# EAGLE design Maduino Zero Bluetooth 4.0 HM-13 v1.0 (EAGLE 6.1)
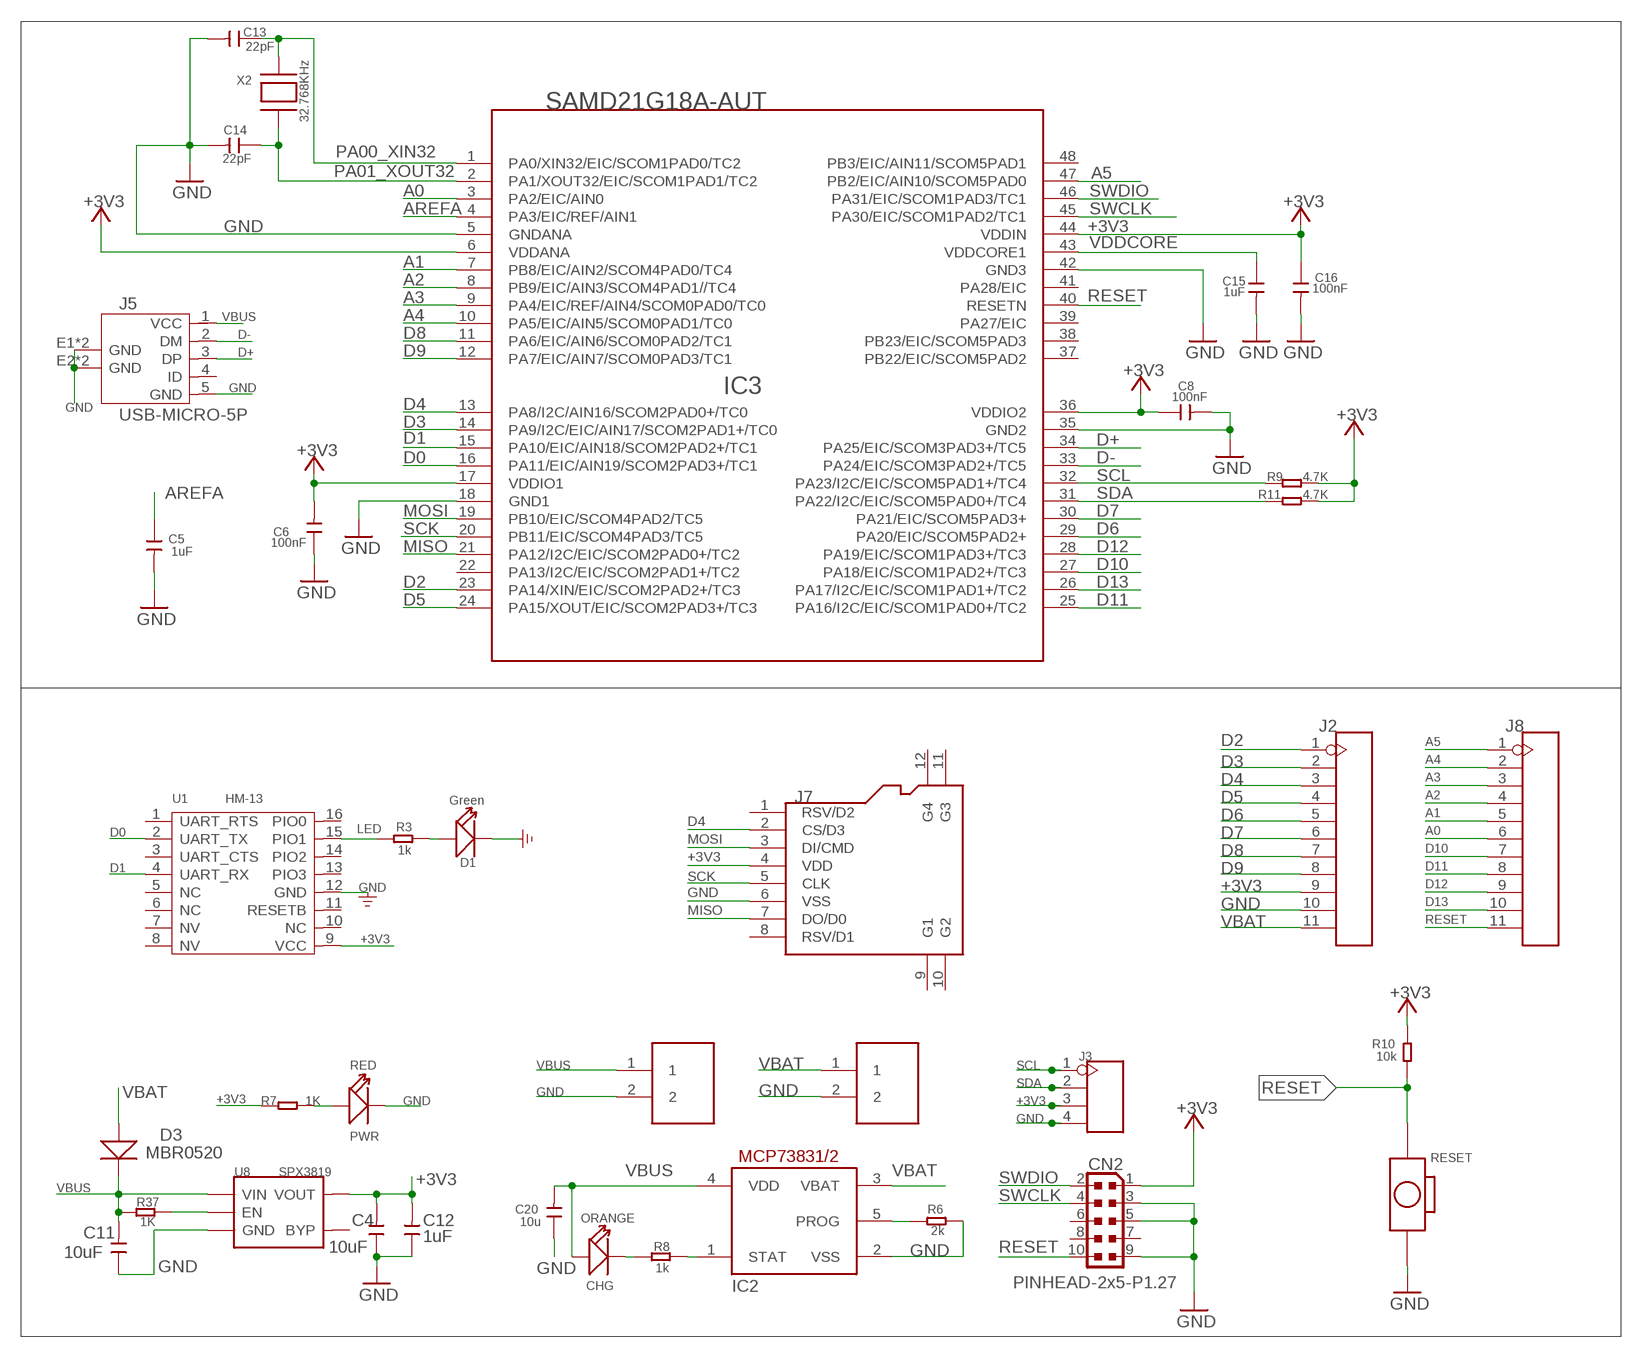
[diagram p0: schematic, sheet 1]

## Parts
C4  10uF  C-0603  [0603]
C5  1uF  C-0603  [0603]
C6  100nF  C-0603  [0603]
C8  100nF  C-0603  [0603]
C11  10uF  C-0603  [0603]
C12  1uF  C-0603  [0603]
C13  22pF  C-0603  [0603]
C14  22pF  C-0603  [0603]
C15  1uF  C-0603  [0603]
C16  100nF  C-0603  [0603]
C20  10u  C-0603  [0603]
CHG  ORANGE  007-LED0603  [D0603]
CN2  PINHEAD-2x5-P1.27  0171_PH127-205DF055G00AROUND-PADS  [PINHEAD_2X05_127]
D1  Green  LED'0603'  [LED-0603]
D3  MBR0520  D'1206'  [SOD123]
IC2  MCP73831/OT  [SOT23-5L]
IC3  SAMD21G18A-AUT  ATSAMD21G18A-AUT  [TQFP48-7X7]
J1  PH2.0-2P-90-DIP  [PH2.0-2P-90-DIP]
J2  HEADER-11P-2.54  [11P-2.54]
J3  HEADER-4P-60/35MILROUND  [4P-65/35ROUND]
J5  USB-MICRO-5P  [MICRO-USB-5P]
J6  PH2.0-2P-90-DIP  [PH2.0-2P-90-DIP]
J7  HOLDER-MICROSD-8P  [8P-SMD]
J8  HEADER-11P-2.54  [11P-2.54]
PWR  RED  LED'0603'  [LED-0603]
R3  1k  R-0603  [R0603]
R6  2k  R-0603  [R0603]
R7  1K  R-0603  [R0603]
R8  1k  R-0603  [R0603]
R9  4.7K  R-0603  [R0603]
R10  10k  R-0603  [R0603]
R11  4.7K  R-0603  [R0603]
R37  1K  R-0603  [R0603]
RESET  BOTTON-2P-90D  [2P-7.62X3.56-90D]
U1  HM-13  HM-11  [16P-18.5X13.5X0.8]
U8  SPX3819  [SOT23-5]
X2  32.768KHz  XTAL-3.2X1.5  [XTAL3215]

## Nets
+3V3: C4.2 C6.2 C8.1 C12.2 C16.1 CN2.1 IC3.6(VDDANA) IC3.17(VDDIO1) IC3.36(VDDIO2) IC3.44(VDDIN) J2.9 J3.3 J7.4(VDD) R7.1 R9.2 R10.2 R11.2 U1.9(VCC) U8.5(VOUT)
A0: IC3.3(PA2/EIC/AIN0) J8.6
A1: IC3.7(PB8/EIC/AIN2/SCOM4PAD0/TC4) J8.5
A2: IC3.8(PB9/EIC/AIN3/SCOM4PAD1//TC4) J8.4
A3: IC3.9(PA4/EIC/REF/AIN4/SCOM0PAD0/TC0) J8.3
A4: IC3.10(PA5/EIC/AIN5/SCOM0PAD1/TC0) J8.2
A5: IC3.47(PB2/EIC/AIN10/SCOM5PAD0) J8.1
AREFA: C5.1 IC3.4(PA3/EIC/REF/AIN1)
D0: IC3.16(PA11/EIC/AIN19/SCOM2PAD3+/TC1) U1.2(UART_TX)
D1: IC3.15(PA10/EIC/AIN18/SCOM2PAD2+/TC1) U1.4(UART_RX)
D2: IC3.23(PA14/XIN/EIC/SCOM2PAD2+/TC3) J2.1
D3: IC3.14(PA9/I2C/EIC/AIN17/SCOM2PAD1+/TC0) J2.2
D4: IC3.13(PA8/I2C/AIN16/SCOM2PAD0+/TC0) J2.3 J7.2(CS/D3)
D5: IC3.24(PA15/XOUT/EIC/SCOM2PAD3+/TC3) J2.4
D6: IC3.29(PA20/EIC/SCOM5PAD2+) J2.5
D7: IC3.30(PA21/EIC/SCOM5PAD3+) J2.6
D8: IC3.11(PA6/EIC/AIN6/SCOM0PAD2/TC1) J2.7
D9: IC3.12(PA7/EIC/AIN7/SCOM0PAD3/TC1) J2.8
D10: IC3.27(PA18/EIC/SCOM1PAD2+/TC3) J8.7
D11: IC3.25(PA16/I2C/EIC/SCOM1PAD0+/TC2) J8.8
D12: IC3.28(PA19/EIC/SCOM1PAD3+/TC3) J8.9
D13: IC3.26(PA17/I2C/EIC/SCOM1PAD1+/TC2) J8.10
D+: IC3.34(PA25/EIC/SCOM3PAD3+/TC5) J5.3(DP)
D-: IC3.33(PA24/EIC/SCOM3PAD2+/TC5) J5.2(DM)
GND: C4.1 C5.2 C6.1 C8.2 C11.1 C12.1 C13.2 C14.2 C15.2 C16.2 C20.1 CN2.3 CN2.5 CN2.9 D1.- IC2.2(VSS) IC3.5(GNDANA) IC3.18(GND1) IC3.35(GND2) IC3.42(GND3) J1.2 J2.10 J3.4 J5.5(GND) J5.E1(GND) J5.E2(GND) J5.P1(GND) J5.P2(GND) J6.2 J7.6(VSS) PWR.- R6.2 RESET.P$2 U1.12(GND) U8.2(GND)
LED: R3.1 U1.15(PIO1)
MISO: IC3.21(PA12/I2C/EIC/SCOM2PAD0+/TC2) J7.7(DO/D0)
MOSI: IC3.19(PB10/EIC/SCOM4PAD2/TC5) J7.3(DI/CMD)
N$3: PWR.+ R7.2
N$7: D1.+ R3.2
N$24: R37.2 U8.3(EN)
N$25: CHG.- R8.1
N$26: IC2.1(STAT) R8.2
N$31: IC2.5(PROG) R6.1
PA00_XIN32: C13.1 IC3.1(PA0/XIN32/EIC/SCOM1PAD0/TC2) X2.P$2
PA01_XOUT32: C14.1 IC3.2(PA1/XOUT32/EIC/SCOM1PAD1/TC2) X2.P$1
RESET: CN2.10 IC3.40(RESETN) J8.11 R10.1 RESET.P$1
SCK: IC3.20(PB11/EIC/SCOM4PAD3/TC5) J7.5(CLK)
SCL: IC3.32(PA23/I2C/EIC/SCOM5PAD1+/TC4) J3.1 R9.1
SDA: IC3.31(PA22/I2C/EIC/SCOM5PAD0+/TC4) J3.2 R11.1
SWCLK: CN2.4 IC3.45(PA30/EIC/SCOM1PAD2/TC1)
SWDIO: CN2.2 IC3.46(PA31/EIC/SCOM1PAD3/TC1)
VBAT: D3.+ IC2.3(VBAT) J2.11 J6.1
VBUS: C11.2 C20.2 CHG.+ D3.- IC2.4(VDD) J1.1 J5.1(VCC) R37.1 U8.1(VIN)
VDDCORE: C15.1 IC3.43(VDDCORE1)
Unconnected: CN2.6 CN2.7 CN2.8 IC3.22(PA13/I2C/EIC/SCOM2PAD1+/TC2) IC3.37(PB22/EIC/SCOM5PAD2) IC3.38(PB23/EIC/SCOM5PAD3) IC3.39(PA27/EIC) IC3.41(PA28/EIC) IC3.48(PB3/EIC/AIN11/SCOM5PAD1) J5.4(ID) J7.1(RSV/D2) J7.8(RSV/D1) J7.9(G1) J7.10(G2) J7.11(G3) J7.12(G4) U1.1(UART_RTS) U1.3(UART_CTS) U1.5(NC) U1.6(NC) U1.7(NV) U1.8(NV) U1.10(NC) U1.11(RESETB) U1.13(PIO3) U1.14(PIO2) U1.16(PIO0) U8.4(BYP)

## Library data of the parts
C4-C6 C8 C11-C16 C20 = Discrete:C*: Ceramic Capacitors
CHG = Discrete:007-LED*
CN2 = Connettori:0171_PH127-205DF055G00A: 2x5 PASSO 1,27
D1 PWR = Discrete:LED*
D3 = Discrete:D*
IC2 = adafruit:MCP73831: MCP73831/2 Miniature Single-Cell, Fully Integrated Li-Ion, Li-Polymer Charge Management Controllers. Nice and small simple lipoly charge controller, with adjustable current and status output (LED) http://www.ladyada.net/library/pcb/eaglelibrary.html
IC3 = IC:ATSAMD21G18A-AUT: Atmel D21 32bit ARM Cortex-M0 microcontroller - 48 PIN TQFP 256KB flash memory + 32KB SRAM
J1 J6 = Connector:PH2.0-2P-90-DIP
J2 J8 = Connector:HEADER-11P
J3 = Connector:HEADER-4P
J5 = Connector:USB-MICRO-5P
J7 = Connector:HOLDER-MICROSD-8P
R3 R6-R11 R37 = Discrete:R*
RESET = Discrete:BOTTON-2P
U1 = template:HM-11: Bluetooth Specification V4.0 BLE
U8 = IC:SPX3819
X2 = adafruit2:XTAL: Low cost SMT crystals, no capacitors included http://www.ladyada.net/library/eagle

## Net classes
0 default: width 0.203 mm, drill 0.305 mm, clearance 0.203 mm
2 gnd: width 0.305 mm, drill 0.559 mm, clearance 0.254 mm
3 usbvcc: width 0.508 mm, drill 0.61 mm, clearance 0.254 mm
4 USBpair: width 0.254 mm, drill 0.406 mm, clearance 0.406 mm

## Board
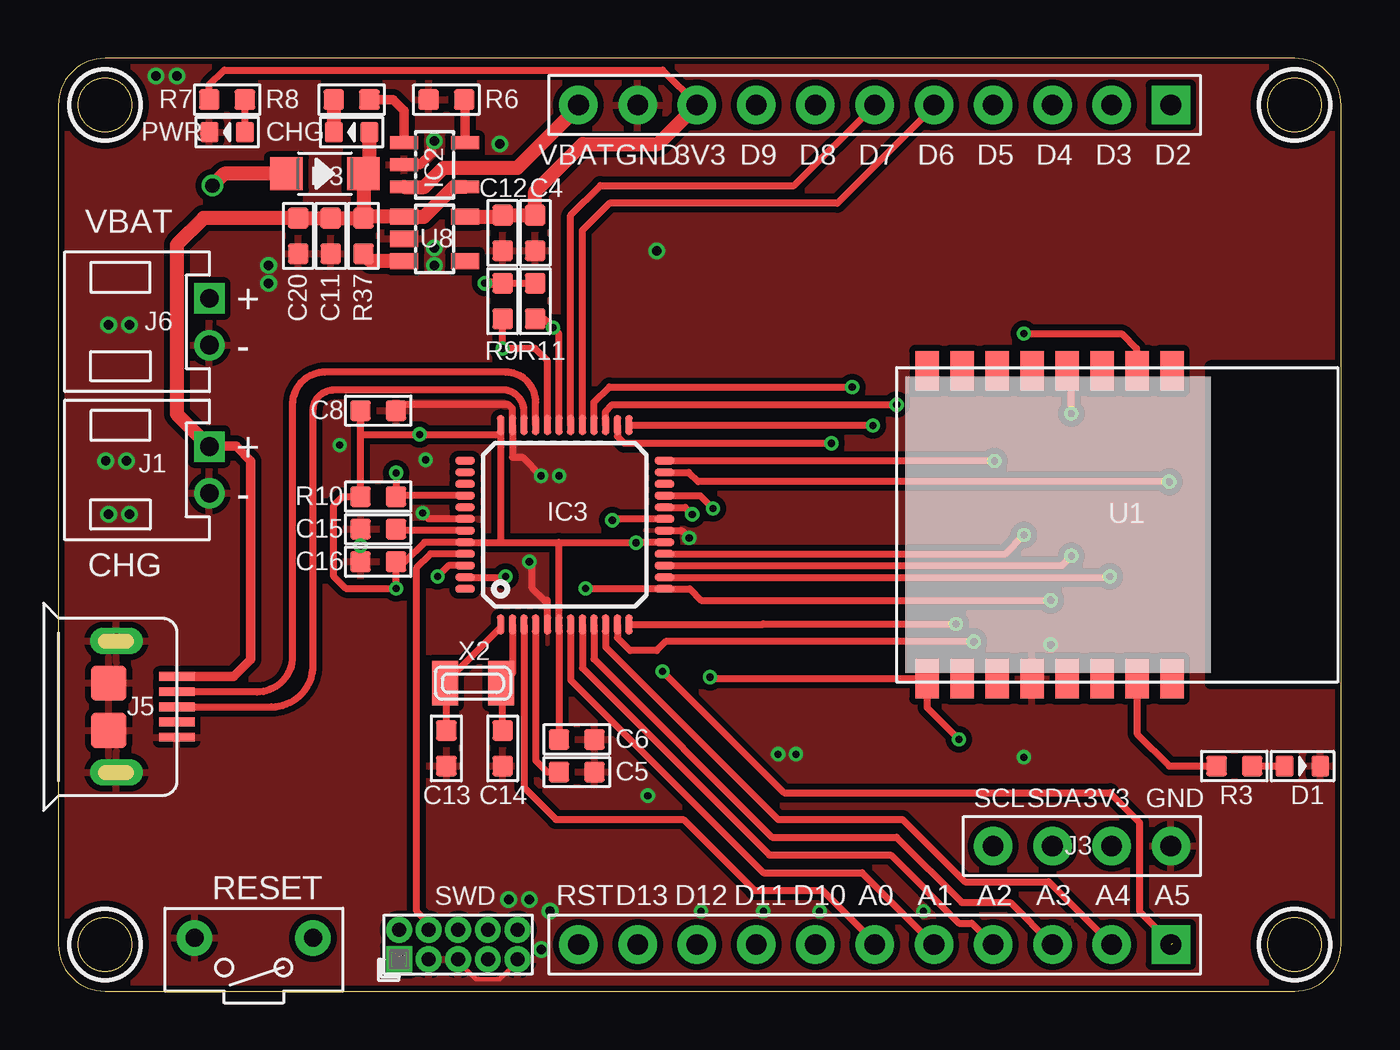
[diagram p1: board, top side]
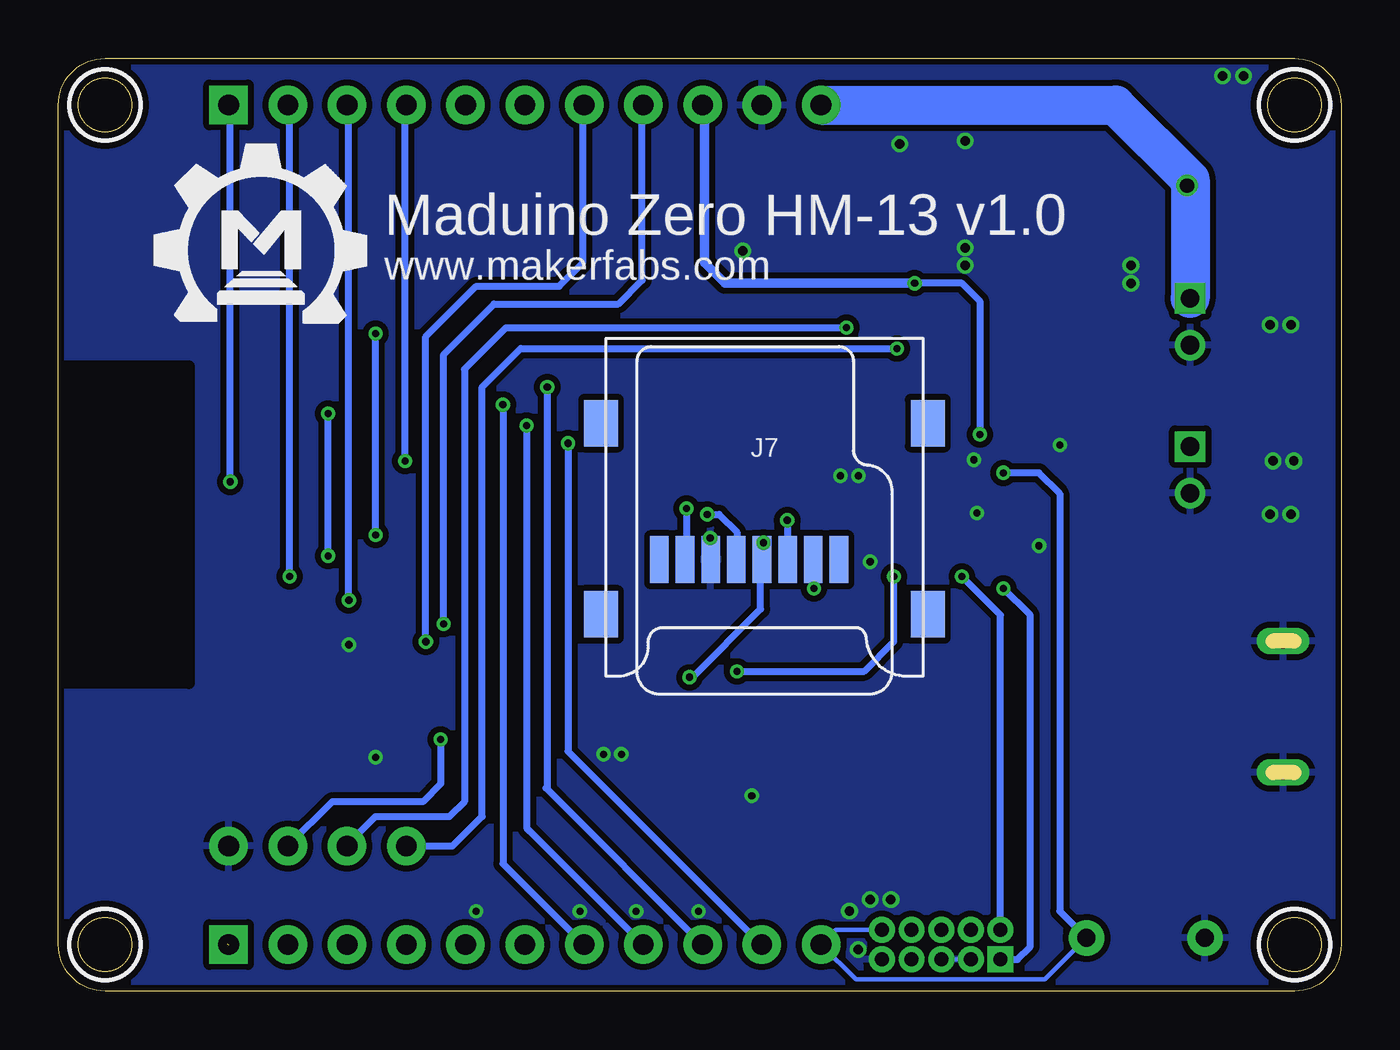
[diagram p2: board, bottom side, seen from below]

Size 55 x 40 mm. Coordinates in mm from the lower left corner, seen from the top.
Outline: 0,38 0,2 arc90 2,0 53,0 arc90 55,2 55,38 arc90 53,40 2,40 arc90 0,38
Outline: circle at 53,2 radius 1.14
Outline: circle at 53,38 radius 1.14
Outline: circle at 2,2 radius 1.14
Outline: circle at 2,38 radius 1.14
Copper layers (1*16): Top 0.035mm / dielectric 1.5mm / Bottom 0.035mm
Design rules: minimum track width 6mil, minimum drill 12mil, track to track 6mil, track to pad 6mil, pad to pad 6mil, via to via 6mil, smd to smd 0mil, copper to edge 10mil, drill to drill 10mil, minimum pad ring 10mil, minimum via ring 6mil, stop-mask expansion 2mil, vias tented up to drill 100mil, thermal gap 10mil
tRestrict: area 51.5,0.5 to 54.5,3.5; area 51.5,36.5 to 54.5,39.5; area 0.5,0.5 to 3.5,3.5; area 0.5,36.5 to 3.5,39.5; area 49.4,13.2 to 54.9,26.8
bRestrict: area 51.5,0.5 to 54.5,3.5; area 51.5,36.5 to 54.5,39.5; area 0.5,0.5 to 3.5,3.5; area 0.5,36.5 to 3.5,39.5; area 49.4,13.2 to 54.9,26.8

### Footprints (pad centres in the part's own frame; a part is rotated, then mirrored left to right if it is on the bottom)
0603 = smd 0.889 x 0.889: 1 -0.762,0; 2 0.762,0
D0603 = smd 0.762 x 0.889: + -0.762,0; - 0.762,0
PINHEAD_2X05_127 = drill 0.6 pad 1.016 square: 1 -0.635,2.54 | drill 0.6 pad 1.016: 2 0.635,2.54; 3 -0.635,1.27; 4 0.635,1.27; 5 -0.635,0; 6 0.635,0; 7 -0.635,-1.27; 8 0.635,-1.27; 9 -0.635,-2.54; 10 0.635,-2.54
LED-0603 = smd 0.762 x 0.889: + -0.762,0; - 0.762,0
SOD123 = smd 1.397 x 1.397: + -1.651,0; - 1.651,0
SOT23-5L = smd 0.55 x 1.2: 1 -0.95,-1.3; 2 0,-1.3; 3 0.95,-1.3; 4 0.95,1.3; 5 -0.95,1.3
TQFP48-7X7 = smd 0.85 x 0.32: 1 -4.275,2.75; 2 -4.275,2.25; 3 -4.275,1.75; 4 -4.275,1.25; 5 -4.275,0.75; 6 -4.275,0.25; 7 -4.275,-0.25; 8 -4.275,-0.75; 9 -4.275,-1.25; 10 -4.275,-1.75; 11 -4.275,-2.25; 12 -4.275,-2.75; 25 4.275,-2.75; 26 4.275,-2.25; 27 4.275,-1.75; 28 4.275,-1.25; 29 4.275,-0.75; 30 4.275,-0.25; 31 4.275,0.25; 32 4.275,0.75; 33 4.275,1.25; 34 4.275,1.75; 35 4.275,2.25; 36 4.275,2.75 | smd 0.32 x 0.85: 13 -2.75,-4.275; 14 -2.25,-4.275; 15 -1.75,-4.275; 16 -1.25,-4.275; 17 -0.75,-4.275; 18 -0.25,-4.275; 19 0.25,-4.275; 20 0.75,-4.275; 21 1.25,-4.275; 22 1.75,-4.275; 23 2.25,-4.275; 24 2.75,-4.275; 37 2.75,4.275; 38 2.25,4.275; 39 1.75,4.275; 40 1.25,4.275; 41 0.75,4.275; 42 0.25,4.275; 43 -0.25,4.275; 44 -0.75,4.275; 45 -1.25,4.275; 46 -1.75,4.275; 47 -2.25,4.275; 48 -2.75,4.275
PH2.0-2P-90-DIP = drill 0.8 square: 1 0,1 | drill 0.8: 2 0,-1
11P-2.54 = drill 0.889 pad 1.651 square: 1 0,12.7 | drill 0.889 pad 1.651: 2 0,10.16; 3 0,7.62; 4 0,5.08; 5 0,2.54; 6 0,0; 7 0,-2.54; 8 0,-5.08; 9 0,-7.62; 10 0,-10.16; 11 0,-12.7
4P-65/35ROUND = drill 0.889 pad 1.651: 1 0,3.81; 2 0,1.27; 3 0,-1.27; 4 0,-3.81
MICRO-USB-5P = smd 0.38 x 1.52: 1 -1.3,0; 2 -0.65,0; 3 0,0; 4 0.65,0; 5 1.3,0 | smd 1.524 x 1.524: E1 -1.016,-2.921; E2 1.016,-2.921 | drill 0.635 pad 1.143 long: P1 -2.819,-2.591; P2 2.819,-2.591
8P-SMD = smd 0.8 x 2.008: 1 -3.198,0.254; 2 -2.098,0.254; 3 -0.998,0.254; 4 0.102,0.254; 5 1.202,0.254; 6 2.302,0.254; 7 3.402,0.254; 8 4.502,0.254 | smd 1.45 x 2: 9 -7.002,2.6; 10 7.002,2.6; 11 -7.002,-5.598; 12 7.002,-5.598
R0603 = smd 0.889 x 0.889: 1 -0.762,0; 2 0.762,0
2P-7.62X3.56-90D = drill 0.762 pad 1.524: P$1 0,2.54; P$2 0,-2.54
16P-18.5X13.5X0.8 = smd 1.7 x 1: 1 -6.6,2.15; 2 -6.6,0.65; 3 -6.6,-0.85; 4 -6.6,-2.35; 5 -6.6,-3.85; 6 -6.6,-5.35; 7 -6.6,-6.85; 8 -6.6,-8.35; 9 6.6,-8.35; 10 6.6,-6.85; 11 6.6,-5.35; 12 6.6,-3.85; 13 6.6,-2.35; 14 6.6,-0.85; 15 6.6,0.65; 16 6.6,2.15
SOT23-5 = smd 0.69 x 1.2: 1 -0.95,-1.3; 2 0,-1.3; 3 0.95,-1.3; 4 0.95,1.3; 5 -0.95,1.3
XTAL3215 = smd 1.1 x 1.9: P$1 1.2,0; P$2 -1.2,0

### Placement (x,y rotation side)
C4  20.45,32.51 90 top
C5  22.23,9.4 0 top
C6  22.23,10.79 180 top
C8  13.72,24.89 0 top
C11  11.68,32.38 90 top
C12  19.05,32.51 90 top
C13  16.64,10.41 270 top
C14  19.05,10.41 270 top
C15  13.72,19.81 180 top
C16  13.72,18.41 180 top
C20  10.29,32.38 90 top
CHG  12.57,36.83 180 top
CN2  17.14,2 90 top
D1  53.34,9.65 0 top
D3  11.43,35.05 0 top
IC2  16.13,35.43 270 top
IC3  21.72,20 90 top
J1  6.48,22.35 0 top
J2  35,38 270 top
J3  43.89,6.22 90 top
J5  5.08,12.19 270 top
J6  6.48,28.7 0 top
J7  24.73,18.76 180 bottom
J8  35,2 270 top
PWR  7.24,36.83 180 top
R3  50.42,9.65 0 top
R6  16.64,38.23 180 top
R7  7.24,38.23 0 top
R8  12.57,38.23 0 top
R9  19.05,29.59 90 top
R10  13.72,21.21 180 top
R11  20.45,29.59 90 top
R37  13.08,32.38 270 top
RESET  8.38,2.29 270 top
U1  45.59,20 270 top
U8  16.13,32.26 270 top
U$1  [MAKERFABS_0.3]  50.43,28.7 0 bottom
X2  17.78,13.21 0 top

### Tracks (layer width: path | path; a pad name or v marks a point on that pad's centre or on a via)
+3V3  (via drill 0.3)
  Top 0.305: 12.95,24.26 C8.1 12.95,23.88 | 12.95,23.88 R10.2 12.19,21.21 11.81,20.83 11.81,17.78 12.32,17.27 v14.48,17.27 C16.1 14.86,18.41 15.69,19.25 IC3.44 19.05,19.25 | R9.2 R11.2 | IC3.17 24.84,19.25 24.77,19.18 v24.77,19.23 24.74,19.25 21.46,19.25 | 19.05,19.25 21.46,19.25 | 21.46,19.25 21.47,19.25 IC3.6 C6.2 | R7.1 6.48,38.86 7.11,39.5 25.91,39.5 27.38,38.02 | 27.38,38.02 27.43,37.97 | J2.9 27.38,38.02 | IC3.36 18.97,19.33 19.05,19.25 | 18.92,23.88 v15.49,23.88 12.95,23.88 | v27.94,13.46 28,13.4 U1.9 37.24,12.16 v38.61,10.79
  Top 0.406: R9.2 v18.29,30.35
  Top 0.61: J2.9 25.7,36.32 22.48,36.32 20.45,34.29 C4.2 C12.2 18.98,33.21 U8.5
  Bottom 0.305: v24.77,19.23 24.77,18.57 | 24.77,18.57 J7.4 | CN2.1 13.88,1.36 13.34,1.91 13.34,16.13 v14.48,17.27 | v15.49,23.88 15.49,29.59 16.26,30.35 v18.29,30.35 | v27.94,13.46 27.81,13.46 24.89,16.38 24.89,18.29 | 24.89,18.41 24.89,18.29 | 24.89,18.29 24.77,18.16 24.77,18.57 | v38.61,10.79 38.61,8.89 39.37,8.13 43.26,8.13 J3.3
  Bottom 0.406: v18.29,30.35 26.42,30.35 27.3,31.24 27.3,37.92 J2.9
A0
  Top 0.305: IC3.3 19.97,8.73 21.34,7.37 26.8,7.37 29.84,4.32 32.77,4.32 35.05,2.03 35.03,2.03 J8.6
A1
  Top 0.305: IC3.7 21.97,13.34 30.23,5.08 34.46,5.08 J8.5
A2
  Top 0.305: IC3.8 22.47,13.86 30.48,5.84 35.69,5.84 38.61,2.92 39.16,2.92 J8.4
A3
  Top 0.305: IC3.9 22.97,14.24 30.61,6.6 35.94,6.6 38.73,3.81 40.81,3.81 J8.3
A4
  Top 0.305: IC3.10 23.47,14.76 30.86,7.37 36.2,7.37 38.86,4.7 42.46,4.7 J8.2
A5  (via drill 0.3)  (1 unrouted)
  Top 0.305: IC3.47 19.15,17.75 v19.18,17.78 | 47.75,2.03 46.35,3.43 46.35,7.24 45.09,8.51 31.11,8.51 v25.91,13.72
  Bottom 0.305: v25.91,13.72 20.45,13.72 19.18,14.99 v19.18,17.78
AREFA
  Top 0.305: IC3.4 20.47,9.89 20.95,9.4 C5.1
D0  (via drill 0.3)
  Top 0.305: IC3.16 40.59,18.75 v41.4,19.56 | v41.4,28.19 45.59,28.19 46.23,27.56 46.23,26.61 U1.2
  Bottom 0.305: v41.4,19.56 v41.4,28.19
D1  (via drill 0.3)
  Top 0.305: 43.31,26.42 43.24,26.48 | 43.24,26.48 43.18,26.54 | 43.24,26.48 U1.4 43.31,26.66 43.31,26.67 43.43,26.54 v43.43,24.77 | IC3.15 43.02,18.25 v43.43,18.67
  Bottom 0.305: v43.43,18.67 v43.43,24.77
D2  (via drill 0.3)
  Top 0.305: IC3.23 27.03,22.25 27.43,21.84 v47.62,21.84
  Bottom 0.305: v47.62,21.84 47.62,37.92 J2.1
D3  (via drill 0.3)
  Top 0.305: IC3.14 45.05,17.75 v45.09,17.78
  Bottom 0.305: 45.16,37.92 J2.2 45.09,37.92 v45.09,17.78
D4  (via drill 0.3)
  Top 0.305: v42.55,16.76 27.56,16.76 27.07,17.25 IC3.13 22.63,17.25 v22.61,17.27
  Bottom 0.305: v42.55,16.76 42.55,37.92 J2.3 | v22.61,17.27 22.61,18.48 J7.2
D5  (via drill 0.3)
  Top 0.305: IC3.24 40.12,22.75 v40.13,22.73
  Bottom 0.305: v40.13,22.73 40.13,37.95 J2.4
D6
  Top 0.305: J2.5 37.57,37.97 37.59,37.97 33.4,33.78 23.62,33.78 22.47,32.63 IC3.29
D7
  Top 0.305: J2.6 31.54,34.54 23.24,34.54 21.97,33.27 IC3.30
D8  (via drill 0.3)
  Top 0.305: IC3.11 23.97,15.15 24.51,14.61 25.65,14.61 26.04,14.99 v39.24,14.99
  Bottom 0.305: v39.24,14.99 39.24,28.07 37.08,30.23 33.53,30.23 32.51,31.24 32.51,37.95 J2.7
D9  (via drill 0.3)
  Top 0.305: IC3.12 30.2,15.72 30.23,15.75 v38.48,15.75
  Bottom 0.305: v38.48,15.75 38.48,27.3 36.32,29.46 30.99,29.46 29.97,30.48 29.97,37.95 J2.8
D10  (via drill 0.3)
  Top 0.305: IC3.27 23.47,24.86 23.75,25.15 v35.94,25.15
  Bottom 0.305: 32.51,2.03 35.94,5.46 v35.94,25.15 | 32.51,1.91 32.51,2.03 | 32.51,2.03 32.38,1.91 32.38,1.93 J8.7
D11  (via drill 0.3)
  Top 0.305: IC3.25 34.91,24.27 v34.92,24.26
  Bottom 0.305: 34.92,7 J8.8 | 34.8,6.86 34.92,6.99 34.92,7 | v34.92,24.26 34.92,7
D12  (via drill 0.3)
  Top 0.305: IC3.28 22.97,25.25 23.62,25.91 v34.04,25.91
  Bottom 0.305: J8.9 34.09,8.71 34.04,8.76 v34.04,25.91
D13  (via drill 0.3)
  Top 0.305: IC3.26 23.97,23.79 24.26,23.5 v33.15,23.5
  Bottom 0.305: J8.10 24.86,2 33.15,10.29 v33.15,23.5
D+
  Top 0.305: IC3.34 19.97,24.86 arc90 19.05,25.78 11.81,25.78 arc90 10.92,24.89 10.92,13.97 arc-90 9.14,12.19 J5.3
D-
  Top 0.305: IC3.33 20.47,25.25 arc90 19.18,26.54 11.43,26.54 arc90 10.03,25.15 10.03,14.35 arc-90 8.51,12.83 5.09,12.83 | 5.09,12.83 arc-90 J5.2 arc90 5.09,12.83
GND  (via drill 0.3, 0.41)
  Top 0.203: CN2.5 17.14,1.27 17.91,0.51 18.92,0.51 19.75,1.33 | 19.75,1.33 19.81,1.4 | CN2.9 19.72,1.36 19.75,1.33
  Top 0.305: IC3.42 15.87,20.25 v15.62,20.5 | C8.2 14.35,24.89 14.61,25.15 19.3,25.15 19.47,24.98 IC3.35 19.47,22.9 19.9,22.9 v20.7,22.1 | IC3.18 26.73,19.75 v27.05,19.43 | IC3.5 20.97,16.75 | 20.97,16.75 20.95,16.76 | 20.97,16.75 20.84,16.75 20.32,17.27 20.32,18.29 v20.19,18.41
  Top 0.406: IC2.2 15.49,35.43 16,35.94 16,36.32 v16.13,36.45
  Bottom 0.203: CN2.5 CN2.3
  Bottom 0.305: v27.05,19.43 27.05,18.53 J7.6
  other vias: 9.02,31.11 18.92,36.32 3.05,28.57 2.16,28.57 16.13,31.88 16.13,31.11 9.02,30.35 3.05,20.45 2.16,20.45 5.08,39.24 4.19,39.24 2.92,22.73 2.03,22.73 20.7,1.78 21.08,3.43 20.19,3.94 19.3,3.94 31.62,10.16 30.86,10.16 25.27,8.38 12.95,19.1 15.75,22.78 12.06,23.42 25.65,31.75 27.56,3.43 30.23,3.43 32.64,3.43 37.08,3.43 21.46,22.1 41.4,10.03 42.55,14.86
  pour Top (isolate 0.254): -1.65,-1.52 56.26,-1.52 56.26,40.77 -1.65,40.77
  pour Bottom (isolate 0.254): -1.65,-1.4 56.13,-1.4 56.13,40.77 -1.65,40.77
LED
  Top 0.305: U1.15 46.24,11.03 47.62,9.65 R3.1
MISO  (via drill 0.3)
  Top 0.305: IC3.21 27.52,21.25 v28.07,20.7
  Bottom 0.305: v28.07,20.7 28.07,18.57 J7.7
MOSI  (via drill 0.3)
  Top 0.305: IC3.19 23.81,20.25 v23.75,20.19
  Bottom 0.305: v23.75,20.19 23.75,18.52 J7.3
N$3
  Top 0.305: PWR.+ R7.2
N$7
  Top 0.305: R3.2 D1.+
N$24
  Top 0.61: U8.3 13.4,31.31 R37.2
N$25
  Top 0.61: R8.1 CHG.-
N$26
  Top 0.406: IC2.1 14.83,37.75 14.35,38.23 R8.2
N$31
  Top 0.406: IC2.5 17.43,38.2 R6.1
PA00_XIN32
  Top 0.305: IC3.1 18.97,15.6 X2.P$2 | C13.1 16.64,13.08 16.51,13.21 X2.P$2 | 16.64,13.21 X2.P$2
PA01_XOUT32
  Top 0.305: IC3.2 19.47,13.62 19.05,13.21 X2.P$1 19.05,13.14 C14.1
RESET  (via drill 0.3)
  Top 0.305: IC3.40 14.52,21.25 R10.1 14.61,21.21 14.48,21.34 v14.48,22.23
  Bottom 0.203: CN2.10 21.66,2.63 J8.11 20.81,0.51 12.7,0.51 RESET.P$1
  Bottom 0.305: v14.48,22.23 12.95,22.23 12.06,21.34 12.06,3.43 RESET.P$1
SCK  (via drill 0.3)
  Top 0.305: IC3.20 26.88,20.75 v27.18,20.45
  Bottom 0.305: v27.18,20.45 26.67,20.45 25.91,19.68 25.91,18.52 J7.5
SCL  (via drill 0.3)
  Top 0.305: IC3.32 20.97,27.04 20.45,27.56 v19.05,27.56 R9.1
  Bottom 0.305: J3.1 38.1,6.22 36.83,7.49 36.83,25.91 35.18,27.56 v19.05,27.56
SDA  (via drill 0.3)
  Top 0.305: IC3.31 21.47,28.19 v21.21,28.45 20.83,28.83 R11.1
  Bottom 0.305: J3.2 42.62,6.27 41.4,7.49 38.23,7.49 37.59,8.13 37.59,26.67 35.81,28.45 v21.21,28.45
SWCLK
  Top 0.305: CN2.4 15.88,2.92 15.37,3.43 15.37,18.16 15.96,18.75 IC3.45
SWDIO  (via drill 0.3)
  Top 0.305: IC3.46 16.73,18.25 v16.26,17.78
  Bottom 0.305: v16.26,17.78 14.61,16.13 CN2.2
VBAT  (via drill 0.61)
  Top 0.61: J2.11 22.33,37.97 22.35,37.97 19.68,35.31 16.51,35.31 15.69,34.48 IC2.3 | D3.+ 7.11,35.05 v6.6,34.54
  Bottom 0.61: v6.6,34.54 6.48,34.54
  Bottom 1.676: J2.11 9.68,38 6.48,34.8 6.48,34.54 J6.1
VBUS
  Top 0.406: J5.1 7.52,13.49 8.26,14.22 8.26,22.73 7.62,23.37 6.49,23.37 J1.1
  Top 0.61: CHG.+ 13.34,34.8 D3.- R37.1 | R37.1 C11.2 C20.2 6.22,33.15 5.08,32 5.08,24.75 J1.1 | IC2.4 16.96,34.48 15.68,33.21 U8.1 13.14,33.21 R37.1
VDDCORE
  Top 0.305: IC3.43 14.54,19.75 C15.1

### Text on the board
tPlace: VBAT | GND | 3V3 | D9 | D8 | D7 | D6 | D5 | D4 | D3 | D2 | VBAT | + | - | + | - | CHG | SCL | SDA | 3V3 | GND | SWD | RST | D13 | D12 | D11 | D10 | A0 | A1 | A2 | A3 | A4 | A5
bNames: Maduino Zero HM-13 v1.0 | www.makerfabs.com